# Altium schematic sheet Buttons.SchDoc
size A; SheetNumber: 10; SheetTotal: 15
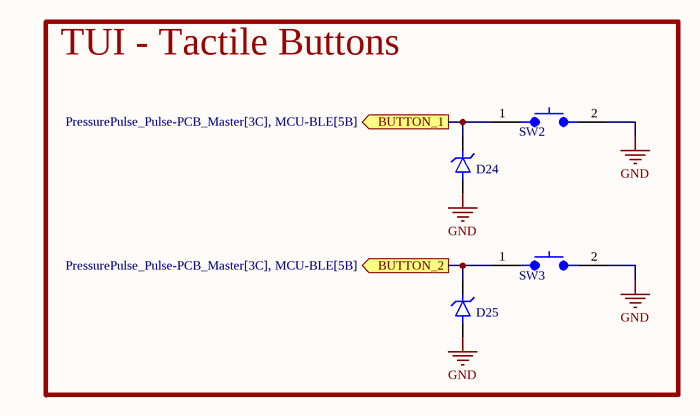
[diagram p0: Buttons.SchDoc]

## Parts
D24  BDFN2C051V40  [BDFN2C051V40]  (value not drawn)
D25  BDFN2C051V40  [BDFN2C051V40]  (value not drawn)
SW2  SPST SMT Tactile Push Button Switch  [TL3302BF180QJ]  (value not drawn)
SW3  SPST SMT Tactile Push Button Switch  [TL3302BF180QJ]  (value not drawn)

## Blocks framed on the sheet
TUI - Tactile Buttons: D24 D25 SW2 SW3

## Ports
BUTTON_1 (out, see PressurePulse_Pulse-PCB_Master[3C], MCU-BLE[5B]), BUTTON_2 (out, see PressurePulse_Pulse-PCB_Master[3C], MCU-BLE[5B])

## Nets
GND: D24.A D25.A SW2.2 SW3.2
BUTTON_1: D24.K SW2.1 ; port BUTTON_1
BUTTON_2: D25.K SW3.1 ; port BUTTON_2

## Library data of the parts
D24 D25 = TVS DIODE: 25V Clamp 4A (8/20µs) Ipp Tvs Diode Surface Mount SLP1006P2; MFR: BORN; Type: SMD; MFR PN: BDFN2C051V40; Value: BDFN2C051V40; JLCPCB PN: C152023
SW2 SW3 = SPST SMT Tactile Push Button Switch: MFR: E-Switch; Value: DNS; MFR PN: TL3302BF180QJ; JLCPCB PN: DNS